# EAGLE schematic general-purpose-breakout (EAGLE 6.5.0)
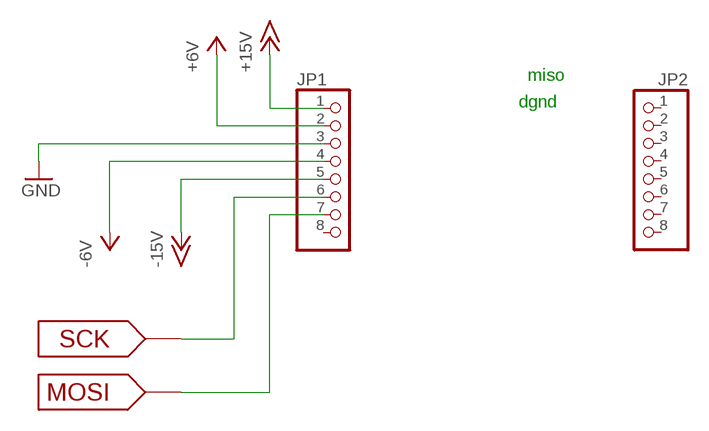
[diagram p0: schematic, sheet 1]

## Parts
JP1  PINHD-1X8  [1X08]
JP2  PINHD-1X8  [1X08]

## Nets
+6V: JP1.2
+15V: JP1.1
-5V: JP1.4 ; supply symbol labelled -6V
-15V: JP1.5
GND: JP1.3
MOSI: JP1.7
SCK: JP1.6
Unconnected: JP1.8 JP2.1 JP2.2 JP2.3 JP2.4 JP2.5 JP2.6 JP2.7 JP2.8

## Notes on the sheet
- miso
- dgnd

## Library data of the parts
JP1 JP2 = pinhead:PINHD-1X8: PIN HEADER